# Altium schematic sheet Propulsion.SchDoc
size C
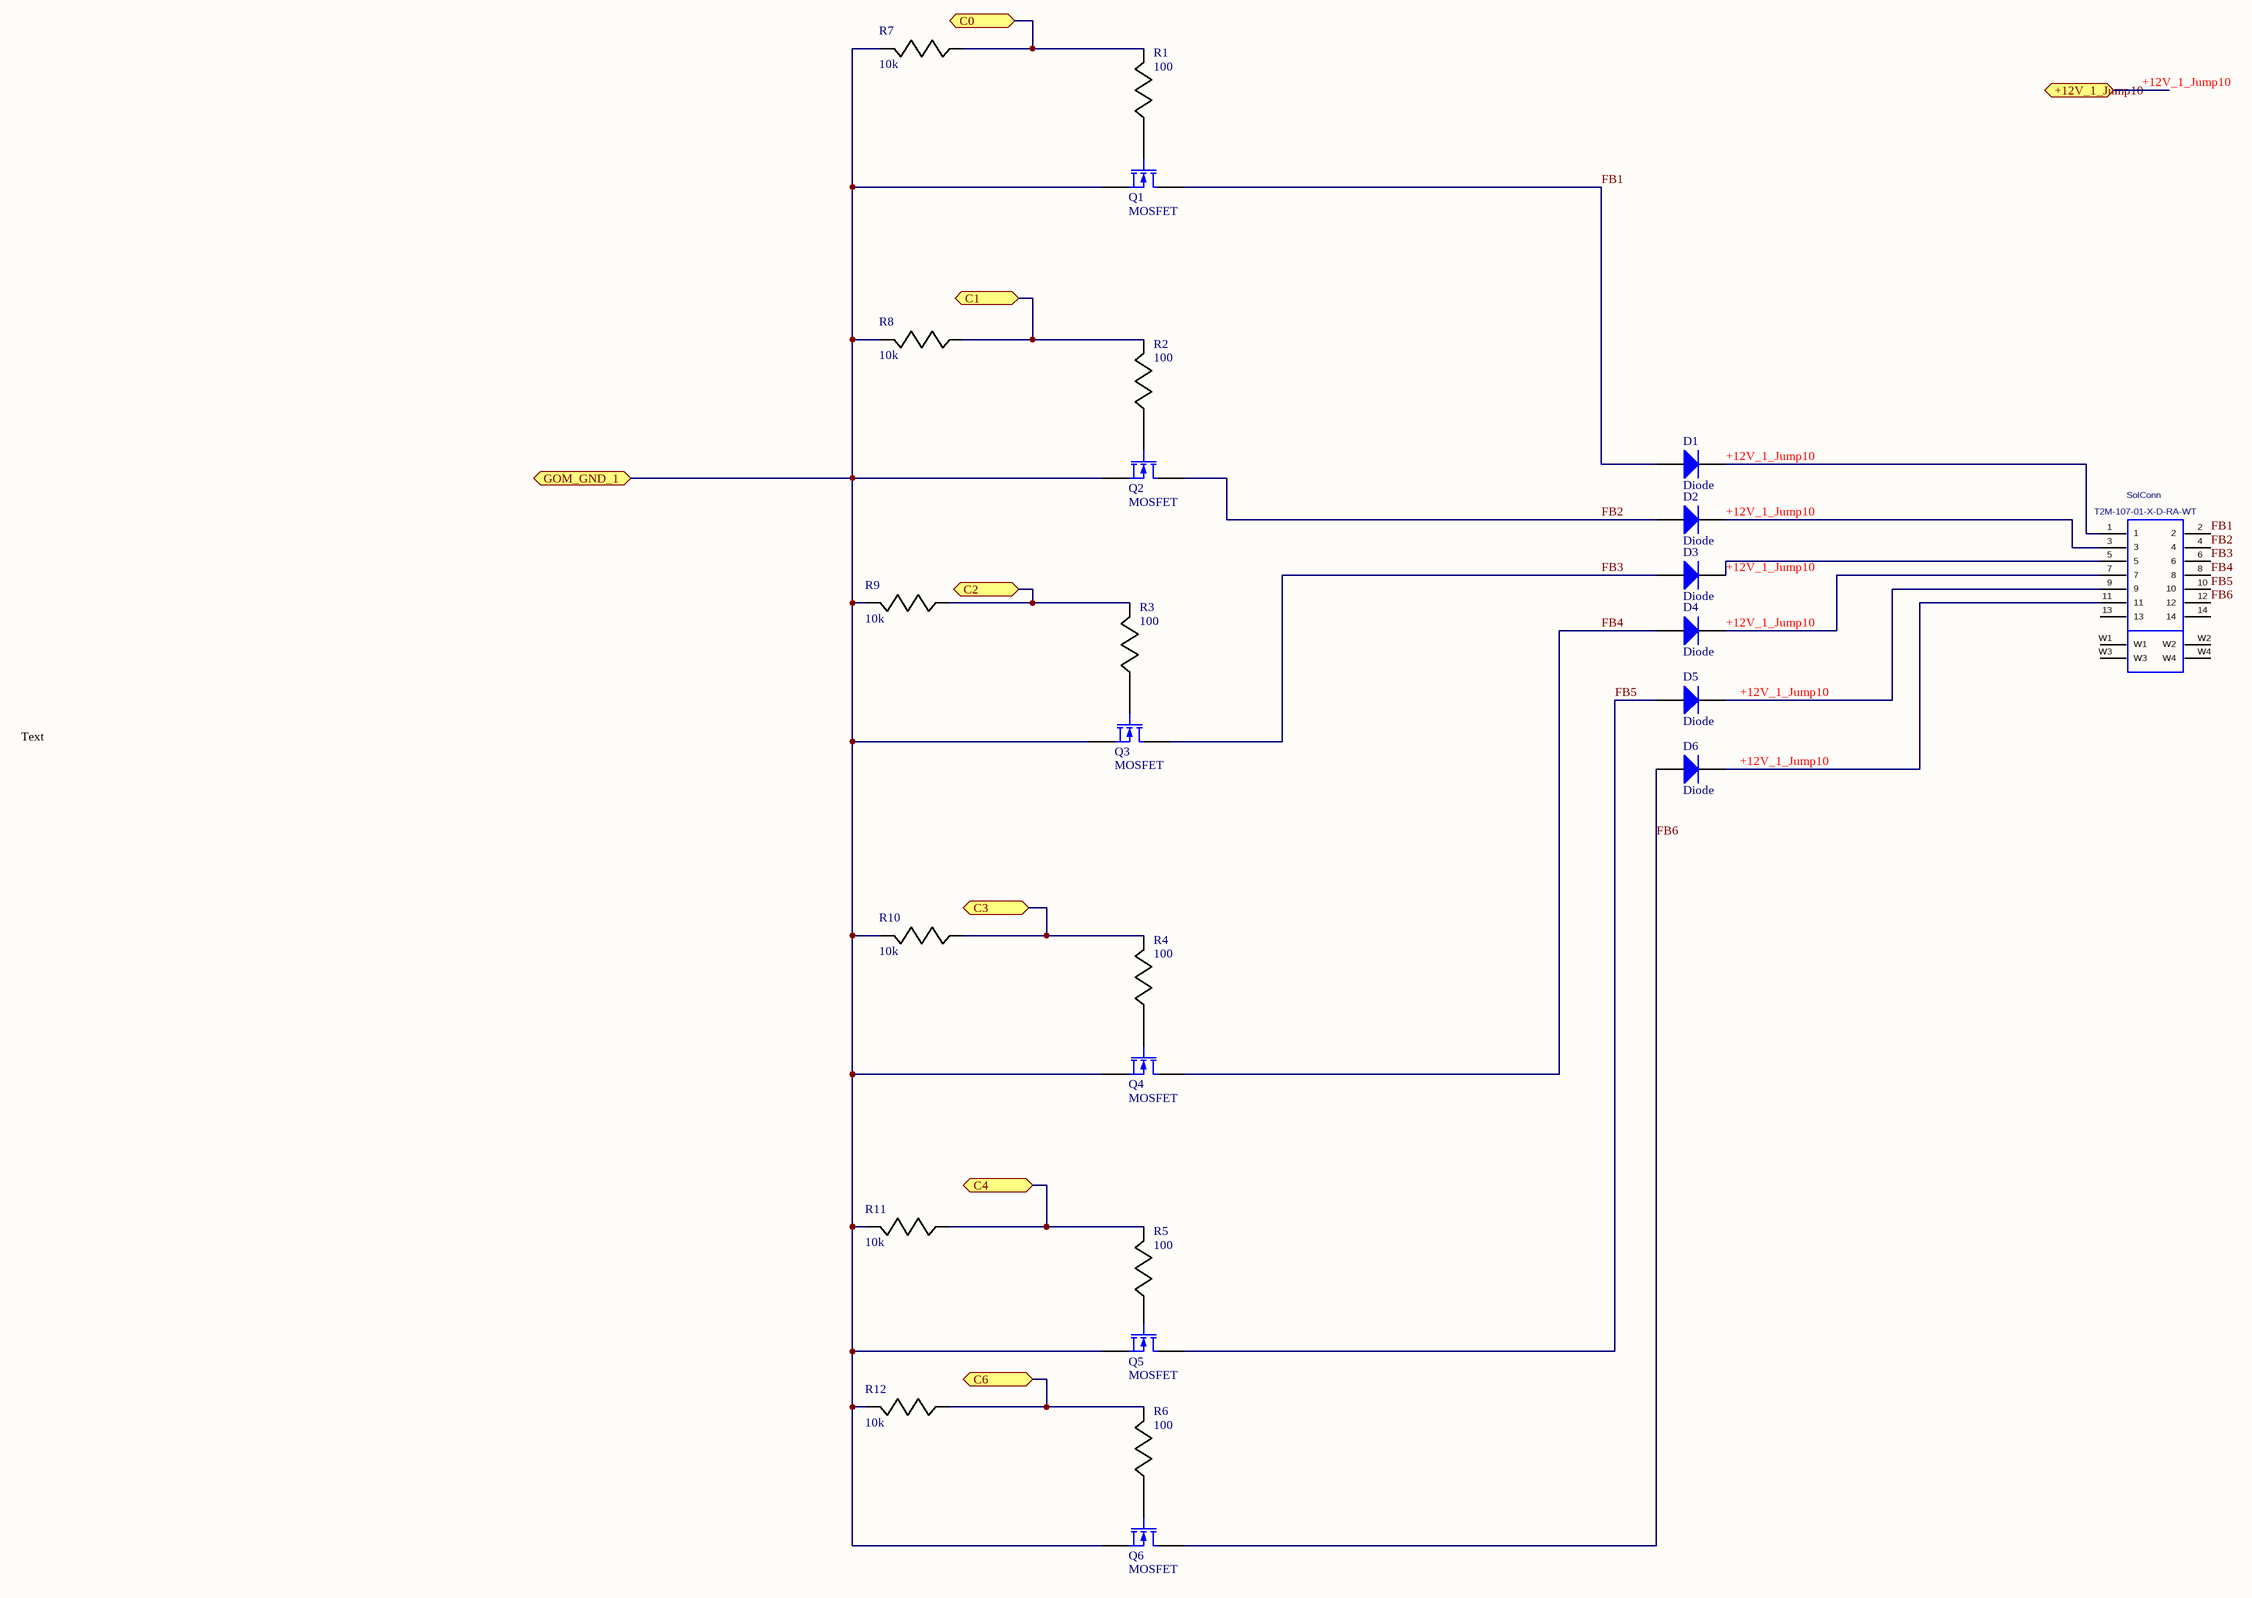
[diagram p0: Propulsion.SchDoc]

## Parts
D1  Diode  [SMC]
D2  Diode  [SMC]
D3  Diode  [SMC]
D4  Diode  [SMC]
D5  Diode  [SMC]
D6  Diode  [SMC]
Q1  MOSFET  [TO-226-AA]
Q2  MOSFET  [TO-226-AA]
Q3  MOSFET  [TO-226-AA]
Q4  MOSFET  [TO-226-AA]
Q5  MOSFET  [TO-226-AA]
Q6  MOSFET  [TO-226-AA]
R1  100  [AXIAL-0.3]
R2  100  [AXIAL-0.3]
R3  100  [AXIAL-0.3]
R4  100  [AXIAL-0.3]
R5  100  [AXIAL-0.3]
R6  100  [AXIAL-0.3]
R7  10k  [AXIAL-0.3]
R8  10k  [AXIAL-0.3]
R9  10k  [AXIAL-0.3]
R10  10k  [AXIAL-0.3]
R11  10k  [AXIAL-0.3]
R12  10k  [AXIAL-0.3]
SolConn  T2M-107-01-X-D-RA-WT  [T2M-107-01-X-D-RA-WT]

## Ports
+12V_1_Jump10 (bidir), C0 (bidir), C1 (bidir), C2 (bidir), C3 (bidir), C4 (bidir), C6 (bidir), GOM_GND_1 (bidir)

## Nets
+12V_1_Jump10: D1.2(K) D2.2(K) D3.2(K) D4.2(K) D5.2(K) D6.2(K) SolConn.1 SolConn.3 SolConn.5 SolConn.7 SolConn.9 SolConn.11 ; port +12V_1_Jump10
C0: R1.1 R7.2 ; port C0
C1: R2.1 R8.2 ; port C1
C2: R3.1 R9.2 ; port C2
C3: R4.1 R10.2 ; port C3
C4: R5.1 R11.2 ; port C4
C6: R6.1 R12.2 ; port C6
FB1: D1.1(A) Q1.1(D) SolConn.2
FB2: D2.1(A) Q2.1(D) SolConn.4
FB3: D3.1(A) Q3.1(D) SolConn.6
FB4: D4.1(A) Q4.1(D) SolConn.8
FB5: D5.1(A) Q5.1(D) SolConn.10
FB6: D6.1(A) Q6.1(D) SolConn.12
GOM_GND_1: Q1.3(S) Q2.3(S) Q3.3(S) Q4.3(S) Q5.3(S) Q6.3(S) R7.1 R8.1 R9.1 R10.1 R11.1 R12.1 ; port GOM_GND_1
NetQ1_2: Q1.2(G) R1.2
NetQ2_2: Q2.2(G) R2.2
NetQ3_2: Q3.2(G) R3.2
NetQ4_2: Q4.2(G) R4.2
NetQ6_2: Q6.2(G) R6.2

Not connected (* = marked no-connect by the designer): Q5 2(G); R5 2; SolConn 13 14 W1 W2 W3 W4

## Notes on the sheet
- Text

## Library data of the parts
D1-D6 = Diode: Default Diode; Published: 8-Jun-2000; LatestRevisionDate: 17-Jul-2002; LatestRevisionNote: Re-released for DXP Platform.; PackageVersion: Sep-1996; PackageReference: SMC; Publisher: Altium Limited; PackageDescription: DO-214-AB/SMC; 2 C-Bend Leads; Body 7.9 x 5.9 mm, inc. leads (LxW); Code_JEDEC: DO-214-AB
Q1-Q6 = MOSFET-N: N-Channel MOSFET; Published: 8-Jun-2000; LatestRevisionDate: 17-Jul-2002; LatestRevisionNote: Re-released for DXP Platform.; PackageVersion: 1995/1996; PackageReference: E3; Publisher: Altium Limited; PackageDescription: TO, Flat Index; 3 In-Line, Axial Leads; Body Dia. 4.6mm; Lead Dia. 0.5 mm (max)
R1-R12 = PMR100HZPFU6L00: Imported; Vendor: Rohm; Value: 6m; Manufacturer_Part_Number: PMR100HZPFU6L00; Manufacturer_Name: Rohm; RefDes: RefDes; TYPE: TYPE
SolConn = T2M-107-01-X-D-RA-WT: 2MM PITCH SHROUDED RIGHT ANGLE TERMINAL STRIP.; MANUFACTURER: SAMTEC; CREATED: September 24, 2014 - Wendy Xin; PCB DECAL: T2M-107-01-X-D-RA-WT